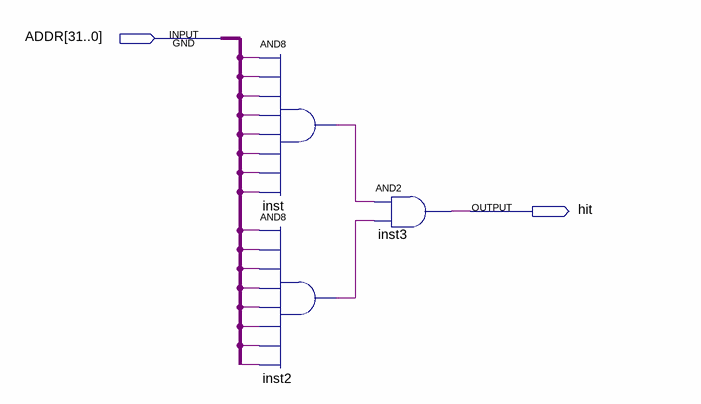
[diagram p0: schematic sheet]
// Quartus schematic per_dc.bdf as structural Verilog: 3 symbols, 2 pins
module per_dc (
  input  [31:0] ADDR,
  output hit
);

  wire inst2_out, inst_out;

  and inst (inst_out, ADDR[31], ADDR[30], ADDR[29], ADDR[28], ADDR[27], ADDR[26], ADDR[25], ADDR[24]);
  and inst2 (inst2_out, ADDR[23], ADDR[22], ADDR[21], ADDR[20], ADDR[19], ADDR[18], ADDR[17], ADDR[16]);
  and inst3 (hit, inst_out, inst2_out);

  // Other names for the same wires on the sheet: a[31:0] = ADDR
endmodule
